# Altium schematic sheet GymkhanaStoper v1.6.SchDoc
size A4; Organization: Altium Limited; Address1: L3, 12a Rodborough Rd; Address2: Frenchs Forest; Address3: NSW; Address4: Australia 2086
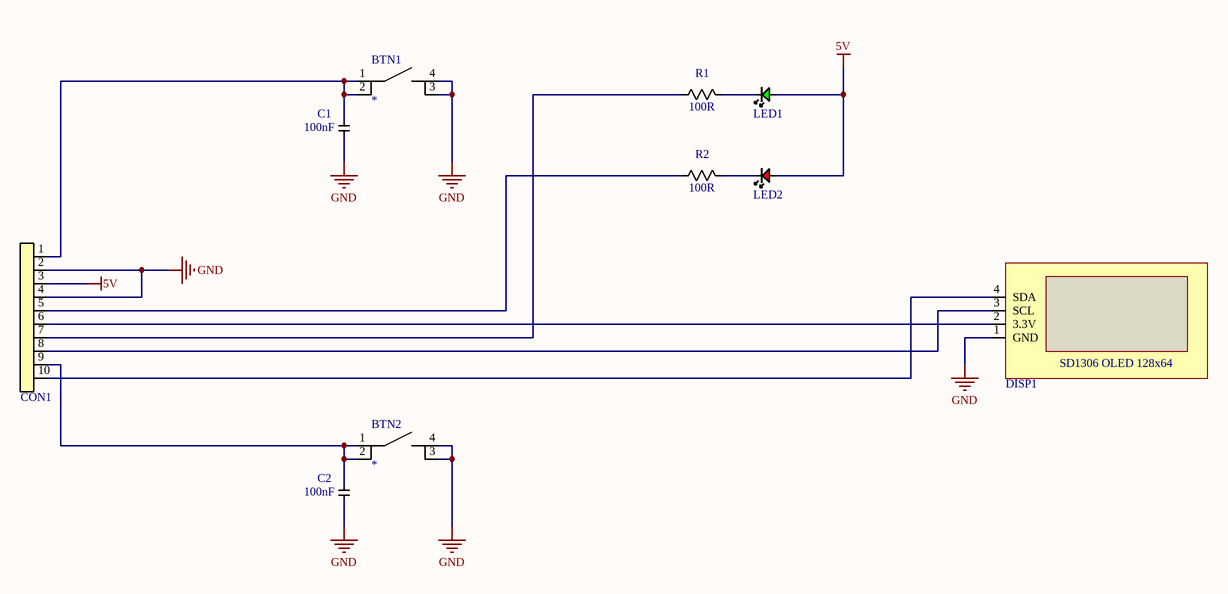
[diagram p0: GymkhanaStoper v1.6.SchDoc]

## Parts
BTN1  *  [TACT12x12]
BTN2  *  [TACT12x12]
C1  Pojemność: 100nF  [0805-C]  (hidden comment: kondensator)
C2  Pojemność: 100nF  [0805-C]  (hidden comment: kondensator)
CON1  *  [IDC10_2.54mm_SMT]  (value not drawn)
DISP1  *  [SD1306-128x64 nohole]  (value not drawn)
LED1  *  [LED5mm_plaska_GREEN]  (value not drawn)
LED2  *  [LED5mm_plaska_RED]  (value not drawn)
R1  Rezystancja: 100R  [0805-R]  (hidden comment: rezystor)
R2  Rezystancja: 100R  [0805-R]  (hidden comment: rezystor)

## Nets
5V: CON1.3 LED1.1(A) LED2.1(A)
GND: BTN1.3 BTN1.4 BTN2.3 BTN2.4 C1.1 C2.1 CON1.2 CON1.4 DISP1.1(GND)
NetBTN1_1: BTN1.1 BTN1.2 C1.2 CON1.1
NetBTN2_1: BTN2.1 BTN2.2 C2.2 CON1.9
NetCON1_5: CON1.5 R2.1
NetCON1_6: CON1.6 DISP1.2(3.3V)
NetCON1_7: CON1.7 R1.1
NetCON1_8: CON1.8 DISP1.3(SCL)
NetCON1_10: CON1.10 DISP1.4(SDA)
NetLED1_2: LED1.2(K) R1.2
NetLED2_2: LED2.2(K) R2.2

## Notes on the sheet
- Tytuł:
- Rozmiar:
- Data:
- A4
- Numer:
- Czas:
- Wersja:
- Strona:
- /
- Plik:
- (in symbol SD1306_128x64) SD1306 OLED 128x64

## Library data of the parts
BTN1 BTN2 = TACT12x12
C1 C2 = C: Napięcie: 100V
CON1 = IDC10_2.54mm
DISP1 = SD1306_128x64
LED1 = Led5mm_green: Led zielona
LED2 = Led5mm_red: Led czerwona
R1 R2 = R: Moc: 1/2 W